# Altium project bumblebee 2.0.PrjPcb
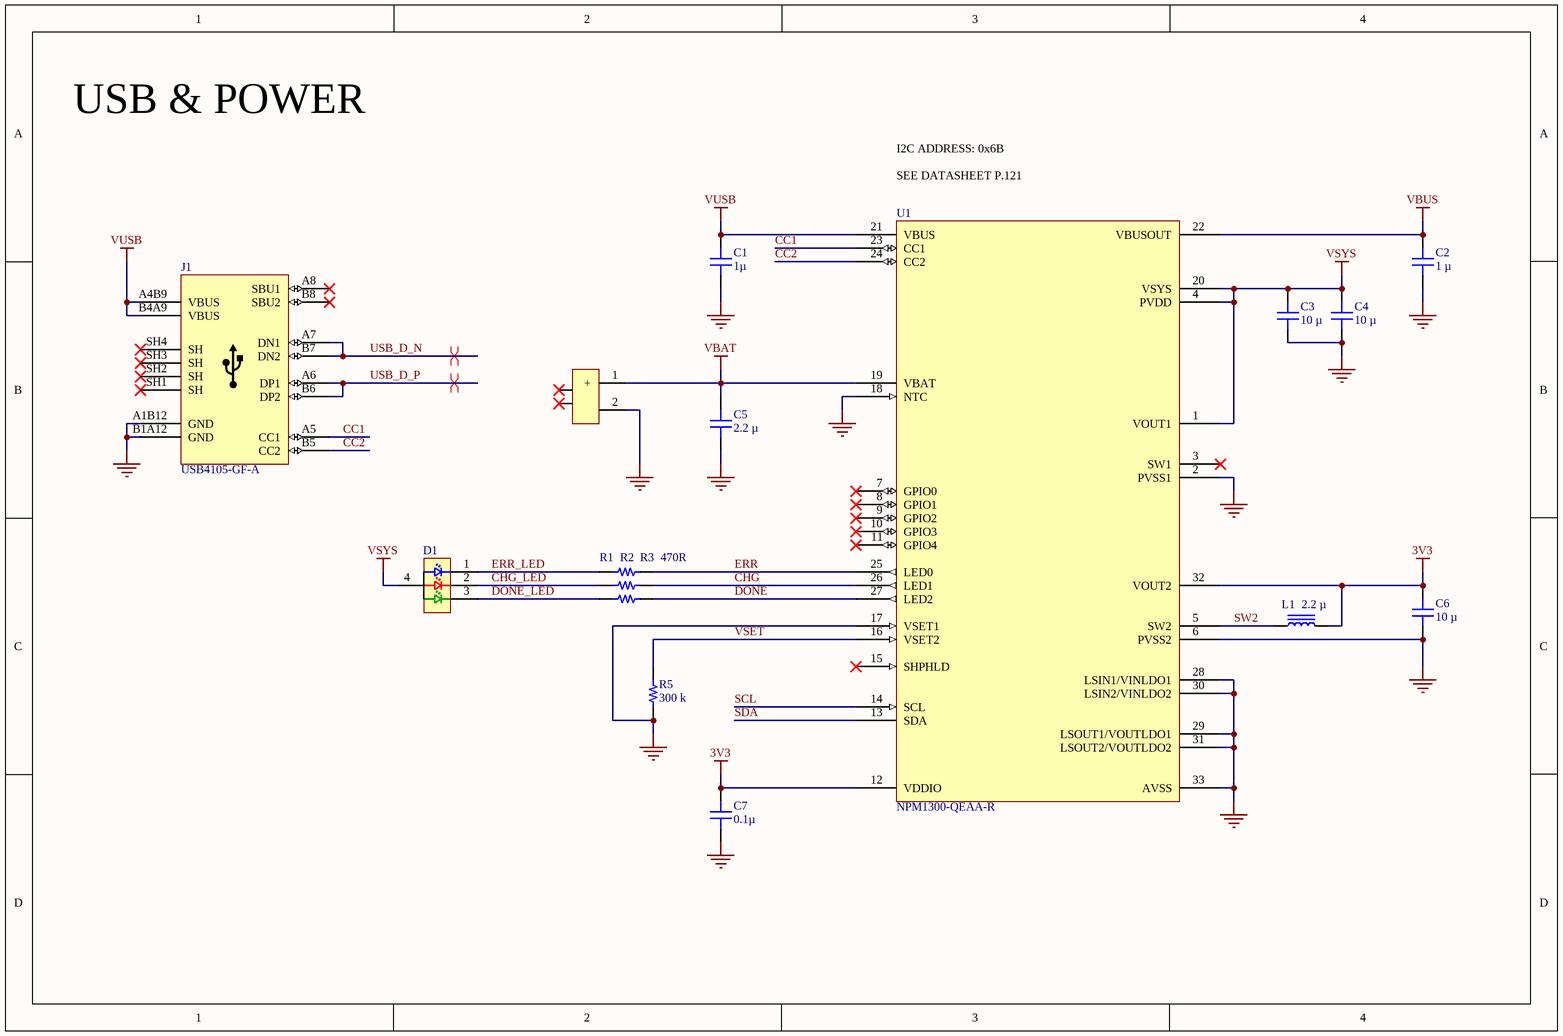
[diagram p0: 1_power.SchDoc]
3 sheets, 50 parts. Net scope: global (net labels, ports and power ports of the same name join across sheets).
Board file: bumblebee.PcbDoc
Sheets:
  1_power.SchDoc
  2_mcu.SchDoc
  3_peripherals.SchDoc

## Sheet 1_power.SchDoc: bumblebee macropad
size A4; DrawnBy: Samir Ahmed; DocumentNumber: 1; Revision: 0.2; SheetNumber: 1; SheetTotal: 3; ENG_APP_DATE: --/--/--; DSN_APP_DATE: --/--/--; CHK_APP_DATE: --/--/--

### Parts
C1  1µ  [CAP 0402_1005]
C2  1 µ  [CAP 0402_1005]
C3  10 µ  [CAP 0402_1005]
C4  10 µ  [CAP 0402_1005]
C5  2.2 µ  [CAP 0402_1005]
C6  10 µ  [CAP 0402_1005]
C7  0.1µ  [CAP 0402_1005]
D1  Red, Green, Blue (RGB)  [Citizen CL-505S-X-SD-T]  (value not drawn)
J1  USB4105-GF-A  [GCT_USB4105-GF-A]
J2  T1M-02-T-SH-L-K  [SAMTEC_T1M-02-T-SH-L-K]  (value not drawn)
L1  2.2 µ  [IND 0402_1005]
R1  470R  [RES 0402_1005]
R2  470 Ohms  [RES 0402_1005]  (value not drawn)
R3  470 Ohms  [RES 0402_1005]  (value not drawn)
R5  300 k  [RES 0402_1005]
U1  NPM1300-QEAA-R  [Nordic_QFN50P500X500X90-33N]

### Nets
3V3: C6.2 C7.2 L1.2 U1.12(VDDIO) U1.32(VOUT2)
GND: C1.1 C2.1 C3.2 C4.2 C5.1 C6.1 C7.1 J1.A1B12(GND) J1.B1A12(GND) J2.2 R5.1 U1.2(PVSS1) U1.6(PVSS2) U1.17(VSET1) U1.18(NTC) U1.28(LSIN1/VINLDO1) U1.29(LSOUT1/VOUTLDO1) U1.30(LSIN2/VINLDO2) U1.31(LSOUT2/VOUTLDO2) U1.33(AVSS)
VBAT: C5.2 J2.1(+) U1.19(VBAT)
VBUS: C2.2 U1.22(VBUSOUT)
VSYS: C3.1 C4.1 D1.4(A3) U1.1(VOUT1) U1.4(PVDD) U1.20(VSYS)
VUSB: C1.2 J1.A4B9(VBUS) J1.B4A9(VBUS) U1.21(VBUS)
CC1: J1.A5(CC1) U1.23(CC1)
CC2: J1.B5(CC2) U1.24(CC2)
CHG: R2.2 U1.26(LED1)
CHG_LED: D1.2(C2) R2.1
DONE: R3.2 U1.27(LED2)
DONE_LED: D1.3(C3) R3.1
ERR: R1.2 U1.25(LED0)
ERR_LED: D1.1(C1) R1.1
SCL: U1.14(SCL)
SDA: U1.13(SDA)
SW2: L1.1 U1.5(SW2)
USB_D_N: J1.A7(DN1) J1.B7(DN2)
USB_D_P: J1.A6(DP1) J1.B6(DP2)
VSET: R5.2 U1.16(VSET2)

Not connected (* = marked no-connect by the designer): J1 A8(SBU1)* B8(SBU2)* SH1(SH)* SH2(SH)* SH3(SH)* SH4(SH)*; J2 S1(NC)* S2(NC)*; U1 3(SW1)* 7(GPIO0)* 8(GPIO1)* 9(GPIO2)* 10(GPIO3)* 11(GPIO4)* 15(SHPHLD)*

### Layout directives
differential pair: USB_D_N, USB_D_P

### Notes on the sheet
- USB & POWER
- (near U1) I2C ADDRESS: 0x6B
  SEE DATASHEET P.121
- DWG. NO.
- REV.
- SHT.
- THIS DOCUMENT AND THE DATA DISCLOSED HEREIN OR HEREWITH IS THE PROPERTY OF ALTIUM LIMITED AND MAY BE FREELY DISTRIBUTED IN WHOLE. NO RIGHTS ARE RESERVED OR EXPRESS OR IMPLIED WARANTEE GIVEN.
- REVISION
- DESCRIPTION
- DATE
- APPROVED
- ENG:
- APPROVALS
- PROJECT
- DSN:
- CHK:
- REFERENCE DOCUMENTS
- PROJECT REVISION:
- TITLE
- DOCUMENT REVISION:
- DESIGN ITEM:
- BOM:
- FAB DWG:
- PCB DWG:
- ASSY DWG:
- SCALE:
- SIZE
- B
- CAGE CODE
- FILE NAME
- DWG NO.
- SHEET
- OF
- REV

### Library data of the parts
C1 = 885012105012: CAP CER 1UF 10V X5R 0402; manufacturer: Würth Elektronik; Capacitance: 1 µF; Tolerance: ±20%; Part Number: 885012105012; Value: 1µ; Applications: General Purpose; componentlink1description: Datasheet; componentlink1url: https://katalog.we-online.de/pbs/datasheet/885012105012.pdf; componentlink2description: DigiKey Link; componentlink2url: https://www.digikey.com/en/products/detail/würth-elektronik/885012105012/5453344; Device Package: 0402 (1005 Metric); lastupdated: 2/9/2024 8:04:38 PM; Lifecycle Status: Active; Minimum Order: 1; Mounting Type: Surface Mount, MLCC; Operating Temperature: -55°C ~ 85°C; Package / Case: 0402 (1005 Metric); packaging: TapeAndReel; partid: 1807; Part Status: Active; price: 0.16; series: WCAP-CSGP; Size / Dimension: 0.039" L x 0.020" W (1.00mm x 0.50mm); Supplier 1: DigiKey; Supplier Part Number 1: 732-7489-1-ND; Temperature Coefficient: X5R; Thickness (Max): 0.022" (0.55mm); Voltage - Rated: 10V
C2 = 885012105012: CAP CER 1UF 10V X5R 0402; manufacturer: Würth Elektronik; Tolerance: ±20%; Part Number: 885012105012; Value: 1 µ; Applications: General Purpose; Capacitance: 1 µ; componentlink1description: Datasheet; componentlink1url: https://katalog.we-online.de/pbs/datasheet/885012105012.pdf; componentlink2description: DigiKey Link; componentlink2url: https://www.digikey.com/en/products/detail/würth-elektronik/885012105012/5453344; Device Package: 0402 (1005 Metric); lastupdated: 2/9/2024 8:04:38 PM; Lifecycle Status: Active; Minimum Order: 1; Mounting Type: Surface Mount, MLCC; Operating Temperature: -55°C ~ 85°C; Package / Case: 0402 (1005 Metric); packaging: TapeAndReel; partid: 1807; Part Status: Active; price: 0.16; series: WCAP-CSGP; Size / Dimension: 0.039" L x 0.020" W (1.00mm x 0.50mm); Supplier 1: DigiKey; Supplier Part Number 1: 732-7489-1-ND; Temperature Coefficient: X5R; Thickness (Max): 0.022" (0.55mm); Voltage - Rated: 10V
C3 C4 C6 = CL05A106MP8NUB8: CAP CER 10UF 10V X5R 0402; manufacturer: Samsung Electro-Mechanics; Capacitance: 10 µF; Tolerance: ±20%; Part Number: CL05A106MP8NUB8; Value: 10 µ; Applications: Acoustic Noise Reduction; componentlink1description: Datasheet; componentlink1url: http://www.samsungsem.com/kr/support/product-search/mlcc/CL05A106MP8NUB8.jsp; componentlink2description: DigiKey Link; componentlink2url: https://www.digikey.com/en/products/detail/samsung-electro-mechanics/CL05A106MP8NUB8/5961314; Device Package: 0402 (1005 Metric); lastupdated: 2/9/2024 8:04:38 PM; Lifecycle Status: Active; Minimum Order: 1; Mounting Type: Surface Mount, MLCC; Operating Temperature: -55°C ~ 85°C; Package / Case: 0402 (1005 Metric); packaging: TapeAndReel; partid: 1758; Part Status: Active; price: 0.06; series: CL; Size / Dimension: 0.039" L x 0.020" W (1.00mm x 0.50mm); Supplier 1: DigiKey; Supplier Part Number 1: 1276-6830-1-ND; Temperature Coefficient: X5R; Thickness (Max): 0.035" (0.90mm); Voltage - Rated: 10V
C5 = TMK105CBJ225KV-F: CAP CER 2.2UF 25V X5R 0402; manufacturer: Taiyo Yuden; Capacitance: 2.2 µF; Tolerance: ±10%; Part Number: TMK105CBJ225KV-F; Value: 2.2 µ; Applications: SMPS Filtering; componentlink1description: Datasheet; componentlink1url: https://ds.yuden.co.jp/TYCOMPAS/ut/detail?pn=TMK105CBJ225KV-F &u=M; componentlink2description: DigiKey Link; componentlink2url: https://www.digikey.com/en/products/detail/taiyo-yuden/TMK105CBJ225KV-F/7403799; Device Package: 0402 (1005 Metric); lastupdated: 2/9/2024 8:04:38 PM; Lifecycle Status: Active; Minimum Order: 1; Mounting Type: Surface Mount, MLCC; Operating Temperature: -55°C ~ 85°C; Package / Case: 0402 (1005 Metric); packaging: TapeAndReel; partid: 1822; Part Status: Active; price: 0.02; series: M; Size / Dimension: 0.039" L x 0.020" W (1.00mm x 0.50mm); Supplier 1: DigiKey; Supplier Part Number 1: 587-6277-1-ND; Temperature Coefficient: X5R; Thickness (Max): 0.028" (0.70mm); Voltage - Rated: 25V
C7 = 0402ZC104KAT2A: CAP CER 0.1UF 10V X7R 0402; manufacturer: AVX Corporation; Capacitance: 0.1µF; Tolerance: ±10%; Part Number: 0402ZC104KAT2A; Value: 0.1µ; Applications: General Purpose; componentlink1description: Datasheet; componentlink1url: http://datasheets.avx.com/X7RDielectric.pdf; componentlink2description: DigiKey Link; componentlink2url: http://digikey.com/product-detail/en/avx-corporation/0402ZC104KAT2A/478-7891-1-ND/3881514; Device Package: 0402 (1005 Metric); lastupdated: 2/8/2022 12:26:59 PM; Lifecycle Status: Active; Minimum Order: 1; Mounting Type: Surface Mount, MLCC; Operating Temperature: -55°C ~ 125°C; Package / Case: 0402 (1005 Metric); packaging: TapeAndReel; partid: 1757; Part Status: Active; price: 0.09; series: -; Size / Dimension: 0.039" L x 0.020" W (1.00mm x 0.50mm); Supplier 1: DigiKey; Supplier Part Number 1: 478-7891-1-ND; Temperature Coefficient: X7R; Thickness (Max): 0.022" (0.55mm); Voltage - Rated: 10V
D1 = CL-505S-X-SD-T: LED TRI TOP FIRING 1.0 X 1.0; Manufacturer: Citizen; Configuration: Common Anode; Current - Test: 5mA Red, 5mA Green, 5mA Blue; Lens Color: 0.26mm; Lens Size: 1.00mm; Lens Style: Square with Flat Top; Millicandela Rating: 40mcd Red, 220mcd Green, 65mcd Blue; Voltage - Forward (Vf) (Typ): 1.85V Red, 2.7V Green, 2.75V Blue; Wavelength - Dominant: 615nm Red, 530nm Green, 470nm Blue; Part Number: CL-505S-X-SD-T; Color: Red, Green, Blue (RGB); ComponentLink1Description: Datasheet; ComponentLink1URL: http://ce.citizen.co.jp/up_img/product/sQNrj4RlM7o2/CL-505S_e.pdf; ComponentLink2Description: DigiKey Link; ComponentLink2URL: http://digikey.com/product-detail/en/citizen/CL-505S-X-SD-T/1642-1510-1-ND/6005950; Device Package: 0404 (1010 Metric); Height (Max): 0.26mm; LastUpdated: 3/19/2020 10:25:23 PM; Lifecycle Status: Active; Minimum Order: 1; Mounting Type: Surface Mount; Package / Case: 0404 (1010 Metric); Packaging: TapeAndReel; PartId: 955; Part Status: Active; Price: 0.23; Series: CL-505S; Size / Dimension: 1.00mm L x 1.00mm W; Supplier 1: DigiKey; Supplier Part Number 1: 1642-1510-1-ND; Value: Red, Green, Blue (RGB)
J1 = CMP-002-00080-3: USB-C (USB TYPE-C) USB 2.0 Receptacle Connector 24 (16+8 Dummy) Position Surface Mount, Right Angle; Through Hole; Gender: Female; Pins: 16; Source: USB4105-GF-A.SchLib; MP: USB4105-GF-A; Mounting Technology: SMT; Connector Type: USB-C; Design Item ID: USB4105-GF-A; Case/Package: None; Component Type: Standard
J2 = CMP-015-000000-3: 1mm JST Connector, surface mounted, horizontal orientation.; Gender: Female; Package: None; RoHS Compliant: RoHS3 Compliant; Mounting Technology: Surface Mounted; Pins: 2; Manufacturer Part #: T1M-02-T-SH-L-K
L1 = FCI1005F-2R2M: IND  2.2UH  1.7OHM  10MA; Manufacturer: TAI-TECH Advanced Electronics Co., Ltd.; DC Resistance (DCR): 1.7Ohm Max; Frequency - Self Resonant: 28MHz; Inductance: 2.2 µH; Inductance Frequency - Test: 10 MHz; Q @ Freq: 20 @ 10MHz; Shielding: Unshielded; Tolerance: ±20%; Part Number: FCI1005F-2R2M; ComponentLink2Description: DigiKey Link; ComponentLink2URL: https://www.digikey.com/en/products/detail/tai-tech-advanced-electronics-co-ltd/FCI1005F-2R2M/21672129; Current Rating (Amps): 10 mA; Device Package: 0402 (1005 Metric); Height - Seated (Max): 0.024" (0.60mm); LastUpdated: 6/3/2024 8:12:05 PM; Lifecycle Status: Active; Minimum Order: 1; Mounting Type: Surface Mount; Operating Temperature: -55°C ~ 105°C; Package / Case: 0402 (1005 Metric); Packaging: TapeAndReel; PartId: 7361; Price: 0.01; Series: FCI1005F; Size / Dimension: 0.039" L x 0.020" W (1.00mm x 0.50mm); Supplier 1: DigiKey; Supplier Part Number 1: 4816-FCI1005F-2R2MCT-ND; Supplier Device Package: 0402; Value: 2.2 µ
R1 = TNPW0402470RBYEP: RES 470 OHM 0.1% 1/16W 0402; Manufacturer: Vishay Dale; Power (Watts): 0.1W, 1/10W; Resistance: 470 Ohms; Temperature Coefficient: ±10ppm/°C; Part Number: TNPW0402470RBYEP; Value: 470R; ComponentLink1Description: Datasheet; ComponentLink1URL: http://www.vishay.com/docs/28758/tnpw_e3.pdf; ComponentLink2Description: DigiKey Link; ComponentLink2URL: http://digikey.com/product-detail/en/vishay-dale/TNPW0402470RBYEP/541-9810-1-ND/9562435; Composition: Thin Film; Device Package: 0402 (1005 Metric); Features: Anti-Sulfur, Automotive AEC-Q200, Moisture Resistant; Height - Seated (Max): 0.016" (0.40mm); LastUpdated: 2/9/2024 8:30:21 PM; Lifecycle Status: Active; Minimum Order: 1; Number of Terminations: 2; Operating Temperature: -55°C ~ 155°C; Package / Case: 0402 (1005 Metric); Packaging: TapeAndReel; PartId: 3068; Part Status: Active; Price: 0.27; Ratings: AEC-Q200; Series: TNPW e3; Size / Dimension: 0.039" L x 0.020" W (1.00mm x 0.50mm); Supplier 1: DigiKey; Supplier Part Number 1: 541-9810-1-ND; Supplier Device Package: 0402; Tolerance: ±0.1%
R2 R3 = TNPW0402470RBYEP: RES 470 OHM 0.1% 1/16W 0402; Manufacturer: Vishay Dale; Power (Watts): 0.1W, 1/10W; Temperature Coefficient: ±10ppm/°C; Part Number: TNPW0402470RBYEP; Value: 470 Ohms; ComponentLink1Description: Datasheet; ComponentLink1URL: http://www.vishay.com/docs/28758/tnpw_e3.pdf; ComponentLink2Description: DigiKey Link; ComponentLink2URL: http://digikey.com/product-detail/en/vishay-dale/TNPW0402470RBYEP/541-9810-1-ND/9562435; Composition: Thin Film; Device Package: 0402 (1005 Metric); Features: Anti-Sulfur, Automotive AEC-Q200, Moisture Resistant; Height - Seated (Max): 0.016" (0.40mm); LastUpdated: 2/9/2024 8:30:21 PM; Lifecycle Status: Active; Minimum Order: 1; Number of Terminations: 2; Operating Temperature: -55°C ~ 155°C; Package / Case: 0402 (1005 Metric); Packaging: TapeAndReel; PartId: 3068; Part Status: Active; Price: 0.27; Ratings: AEC-Q200; Resistance: 470 Ohms; Series: TNPW e3; Size / Dimension: 0.039" L x 0.020" W (1.00mm x 0.50mm); Supplier 1: DigiKey; Supplier Part Number 1: 541-9810-1-ND; Supplier Device Package: 0402; Tolerance: ±0.1%
R5 = RC0402JR-07300KL: RES 300K OHM 5% 1/16W 0402; Manufacturer: Yageo; Power (Watts): 0.063W, 1/16W; Resistance: 300 kOhms; Temperature Coefficient: ±100ppm/°C; Part Number: RC0402JR-07300KL; Value: 300 k; ComponentLink1Description: Datasheet; ComponentLink1URL: https://www.yageo.com/upload/media/product/productsearch/datasheet/rchip/PYu-RC_Group_51_RoHS_L_10.pdf; ComponentLink2Description: DigiKey Link; ComponentLink2URL: https://www.digikey.com/en/products/detail/yageo/RC0402JR-07300KL/726462; Composition: Thick Film; Device Package: 0402 (1005 Metric); Features: Moisture Resistant; Height - Seated (Max): 0.016" (0.40mm); LastUpdated: 2/9/2024 8:30:13 PM; Lifecycle Status: Active; Minimum Order: 1; Number of Terminations: 2; Operating Temperature: -55°C ~ 155°C; Package / Case: 0402 (1005 Metric); Packaging: CutTape; PartId: 4858; Part Status: Active; Price: 0.01; Series: RC_L; Size / Dimension: 0.039" L x 0.020" W (1.00mm x 0.50mm); Supplier 1: DigiKey; Supplier Part Number 1: 311-300KJRCT-ND; Supplier Device Package: 0402; Tolerance: ±5%
U1 = CMP-00029-00006-5: Battery Power Management IC Lithium Ion/Polymer 32-QFN (5x5); Max Operating Temperature: 85°C; Manufacturer Part #: NPM1300-QEAA-R; Mounting Technology: Surface Mount; Min Operating Temperature: 40°C; RoHS Compliant: ROHS3 Compliant; JLCPCB Part #: C7466043; Pins: 33; Case/Package: 32-QFN (5x5)

## Sheet 2_mcu.SchDoc
size A4; SheetNumber: 2; SheetTotal: 2
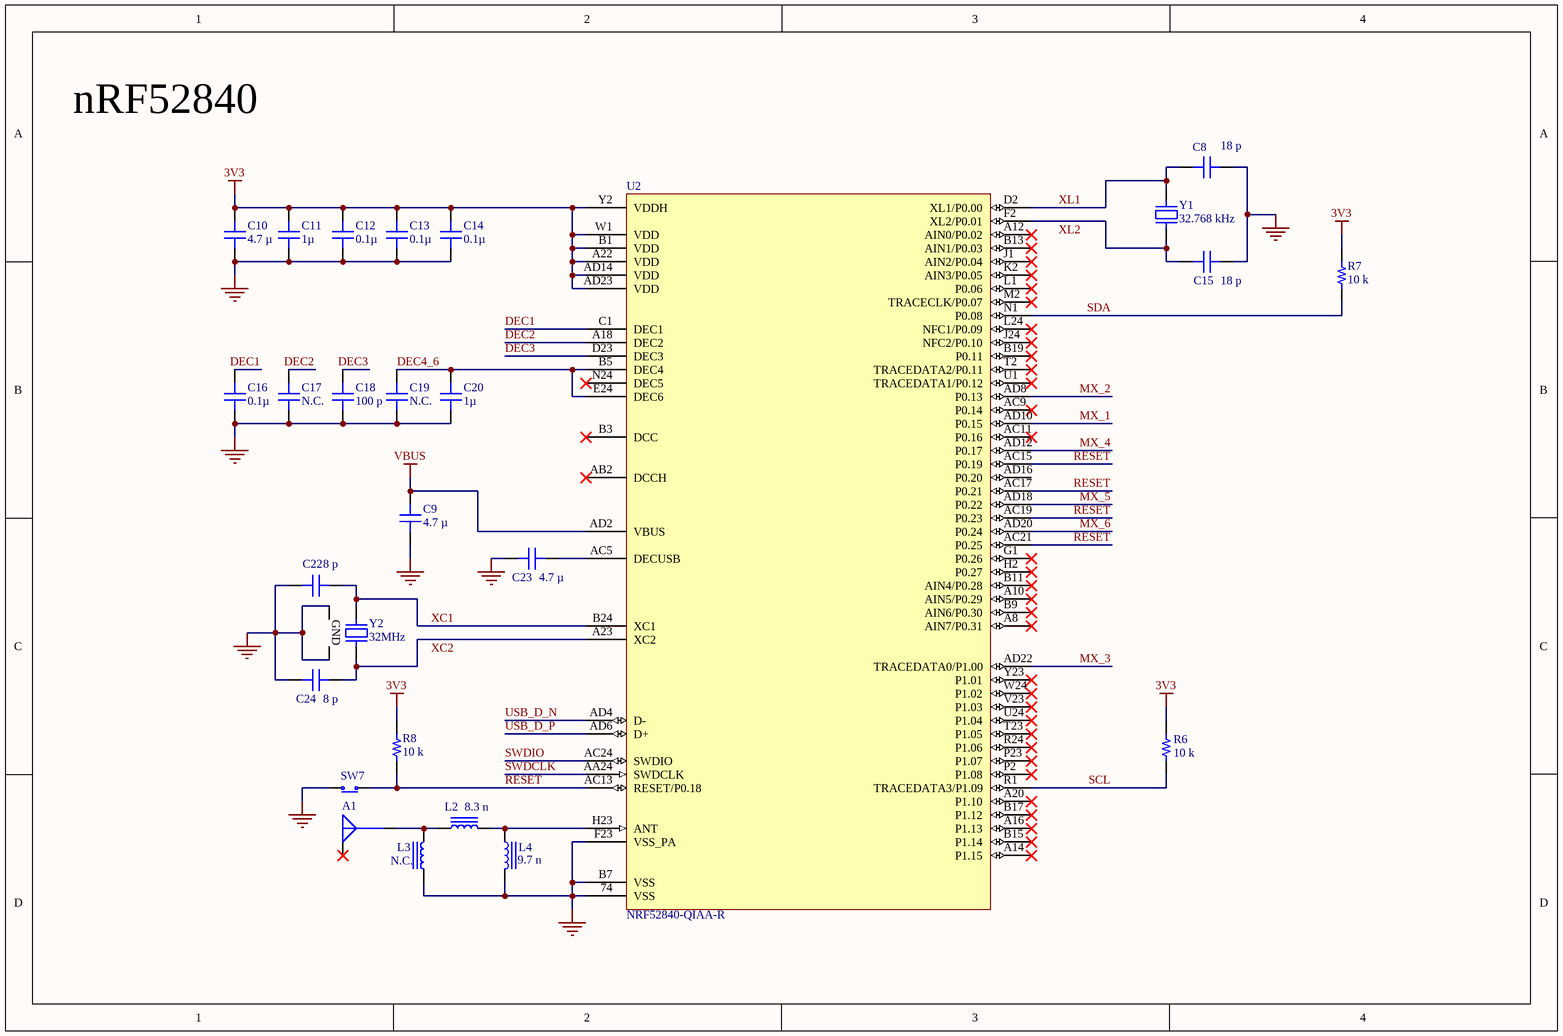
[diagram p1: 2_mcu.SchDoc]

### Parts
A1  AMCA31-2R450G-S1F-T3  [FP-AMCA31-MFG]  (value not drawn)
C8  18 p  [CAP 0402_1005]
C9  4.7 µ  [CAP 0402_1005]
C10  4.7 µ  [CAP 0402_1005]
C11  1µ  [CAP 0402_1005]
C12  0.1µ  [CAP 0402_1005]
C13  0.1µ  [CAP 0402_1005]
C14  0.1µ  [CAP 0402_1005]
C15  18 p  [CAP 0402_1005]
C16  0.1µ  [CAP 0402_1005]
C17  N.C.  [CAP 0402_1005]
C18  100 p  [CAP 0402_1005]
C19  N.C.  [CAP 0402_1005]
C20  1µ  [CAP 0402_1005]
C22  8 p  [CAP 0402_1005]
C23  4.7 µ  [CAP 0402_1005]
C24  8 p  [CAP 0402_1005]
L2  8.3 n  [IND 0402_1005]
L3  N.C.  [IND 0402_1005]
L4  9.7 n  [IND 0402_1005]
R6  10 k  [RES 0402_1005]
R7  10 k  [RES 0402_1005]
R8  10 k  [RES 0402_1005]
SW7  PTS840 GK SMTR LFS  [EVQP7A_J_B_K]  (value not drawn)
U2  NRF52840-QIAA-R  [NRSC-AQFN-73]
Y1  32.768 kHz  [ABRACON ABS06]
Y2  32MHz  [BT-XTAL_2016]

### Nets
3V3: C10.2 C11.2 C12.2 C13.2 C14.2 R6.1 R7.2 R8.1 U2.A22(VDD) U2.AD14(VDD) U2.AD23(VDD) U2.B1(VDD) U2.W1(VDD) U2.Y2(VDDH)
GND: C8.2 C9.1 C10.1 C11.1 C12.1 C13.1 C14.1 C15.2 C16.1 C17.1 C18.1 C19.1 C20.1 C22.1 C23.2 C24.1 L3.1 L4.2 SW7.1(N.O) U2.74(VSS) U2.B7(VSS) U2.F23(VSS_PA) Y2.2(GND) Y2.4(GND)
VBUS: C9.2 U2.AD2(VBUS)
DEC1: C16.2 U2.C1(DEC1)
DEC2: C17.2 U2.A18(DEC2)
DEC3: C18.2 U2.D23(DEC3)
DEC4_6: C19.2 C20.2 U2.B5(DEC4) U2.E24(DEC6)
MX_1: U2.AD10(P0.15)
MX_2: U2.AD8(P0.13)
MX_3: U2.AD22(TRACEDATA0/P1.00)
MX_4: U2.AD12(P0.17)
MX_5: U2.AD18(P0.22)
MX_6: U2.AD20(P0.24)
RESET: R8.2 SW7.2(COM) U2.AC13(RESET/P0.18) U2.AC15(P0.19) U2.AC17(P0.21) U2.AC19(P0.23) U2.AC21(P0.25)
SCL: R6.2 U2.R1(TRACEDATA3/P1.09)
SDA: R7.1 U2.N1(P0.08)
SWDCLK: U2.AA24(SWDCLK)
SWDIO: U2.AC24(SWDIO)
USB_D_N: U2.AD4(D-)
USB_D_P: U2.AD6(D+)
XC1: C22.2 U2.B24(XC1) Y2.1(IN)
XC2: C24.2 U2.A23(XC2) Y2.3(OUT)
XL1: C8.1 U2.D2(XL1/P0.00) Y1.2
XL2: C15.1 U2.F2(XL2/P0.01) Y1.1
NetA1_1: A1.1(Feed_Point) L2.1 L3.2
NetC23_1: C23.1 U2.AC5(DECUSB)
NetL2_2: L2.2 L4.1 U2.H23(ANT)

Not connected (* = marked no-connect by the designer): A1 2(NC)*; U2 A8(AIN7/P0.31)* A10(AIN5/P0.29)* A12(AIN0/P0.02)* A14(P1.15)* A16(P1.13)* A20(P1.10)* AB2(DCCH)* AC9(P0.14)* AC11(P0.16)* AD16(P0.20) B3(DCC)* B9(AIN6/P0.30)* B11(AIN4/P0.28)* B13(AIN1/P0.03)* B15(P1.14)* B17(P1.12)* B19(P0.11)* G1(P0.26)* H2(P0.27)* J1(AIN2/P0.04)* J24(NFC2/P0.10)* K2(AIN3/P0.05)* L1(P0.06)* L24(NFC1/P0.09)* M2(TRACECLK/P0.07)* N24(DEC5)* P2(P1.08)* P23(P1.07)* R24(P1.06)* T2(TRACEDATA2/P0.11)* T23(P1.05)* U1(TRACEDATA1/P0.12)* U24(P1.04)* V23(P1.03)* W24(P1.02)* Y23(P1.01)*

### Notes on the sheet
- nRF52840
- Title:
- Project:
- Revision:
- Organization:
- Date:
- Sheet
- of
- University of South Florida
- Drawn by:
- File:
- Size:

### Library data of the parts
A1 = CMP-00025-00004-1: 2.45GHz Bluetooth, IoT, ISM, M2M, Wi-Fi, ZigBee™ Chip RF Antenna 2.4GHz ~ 2.5GHz 2.3dBi Solder Surface Mount; Power - Max: 3 W; Impedance: 50Ω; RF Family/Standard: Bluetooth, General ISM, WiFi; Frequency: 2.45GHz; Case/Package: Chip; RoHS Compliant: ROHS3 Compliant; Pins: 2; Gain: 2.3dBi; Max Operating Temperature: 85°C; Mounting Technology: Surface Mount; Min Operating Temperature: -40°C
C8 C15 = HMK105CG180JV-F: CAP CER 18PF 100V C0G/NP0 0402; manufacturer: Taiyo Yuden; Temperature Coefficient: C0G, NP0; Tolerance: ±5%; Part Number: HMK105CG180JV-F; Value: 18 p; Applications: General Purpose; Capacitance: 18 pF; componentlink1description: Datasheet; componentlink1url: http://www.yuden.co.jp/productdata/catalog/mlcc06_e.pdf; componentlink2description: DigiKey Link; componentlink2url: https://www.digikey.com/en/products/detail/taiyo-yuden/HMK105CG180JV-F/6563596; Device Package: 0402 (1005 Metric); lastupdated: 2/9/2024 8:04:38 PM; Lifecycle Status: Active; Minimum Order: 1; Mounting Type: Surface Mount, MLCC; Operating Temperature: -55°C ~ 125°C; Package / Case: 0402 (1005 Metric); packaging: TapeAndReel; partid: 1849; Part Status: Active; price: 0.03; series: M; Size / Dimension: 0.039" L x 0.020" W (1.00mm x 0.50mm); Supplier 1: DigiKey; Supplier Part Number 1: 587-5003-1-ND; Thickness (Max): 0.022" (0.55mm); Voltage - Rated: 100V
C9 C10 C23 = CL05A475MO5NUNC: CAP CER 4.7UF 16V X5R 0402; manufacturer: Samsung Electro-Mechanics; Capacitance: 4.7 µF; Tolerance: ±20%; Part Number: CL05A475MO5NUNC; Value: 4.7 µ; Applications: General Purpose; componentlink1description: Datasheet; componentlink1url: http://www.samsungsem.com/kr/support/product-search/mlcc/__icsFiles/afieldfile/2019/05/29/Data%20sheet_CL05A475MO5NUNC.pdf; componentlink2description: DigiKey Link; componentlink2url: https://www.digikey.com/en/products/detail/samsung-electro-mechanics/CL05A475MO5NUNC/5961320; Device Package: 0402 (1005 Metric); lastupdated: 2/9/2024 8:04:38 PM; Lifecycle Status: Active; Minimum Order: 1; Mounting Type: Surface Mount, MLCC; Operating Temperature: -55°C ~ 85°C; Package / Case: 0402 (1005 Metric); packaging: TapeAndReel; partid: 1760; Part Status: Active; price: 0.08; series: CL; Size / Dimension: 0.039" L x 0.020" W (1.00mm x 0.50mm); Supplier 1: DigiKey; Supplier Part Number 1: 1276-6836-1-ND; Temperature Coefficient: X5R; Thickness (Max): 0.028" (0.70mm); Voltage - Rated: 16V
C11 C20 = 885012105012: as C1 on sheet 1_power; Part Number: 885012105012; Value: 1µ; Applications: General Purpose; componentlink1description: Datasheet; componentlink1url: https://katalog.we-online.de/pbs/datasheet/885012105012.pdf; componentlink2description: DigiKey Link; componentlink2url: https://www.digikey.com/en/products/detail/würth-elektronik/885012105012/5453344; Device Package: 0402 (1005 Metric); lastupdated: 2/9/2024 8:04:38 PM; Lifecycle Status: Active; Minimum Order: 1; Mounting Type: Surface Mount, MLCC; Operating Temperature: -55°C ~ 85°C; Package / Case: 0402 (1005 Metric); packaging: TapeAndReel; partid: 1807; Part Status: Active; price: 0.16; series: WCAP-CSGP; Size / Dimension: 0.039" L x 0.020" W (1.00mm x 0.50mm); Supplier 1: DigiKey; Supplier Part Number 1: 732-7489-1-ND; Temperature Coefficient: X5R; Thickness (Max): 0.022" (0.55mm); Voltage - Rated: 10V
C12-C14 C16 C17 C19 = 0402ZC104KAT2A: as C7 on sheet 1_power; Part Number: 0402ZC104KAT2A; Applications: General Purpose; componentlink1description: Datasheet; componentlink1url: http://datasheets.avx.com/X7RDielectric.pdf; componentlink2description: DigiKey Link; componentlink2url: http://digikey.com/product-detail/en/avx-corporation/0402ZC104KAT2A/478-7891-1-ND/3881514; Device Package: 0402 (1005 Metric); lastupdated: 2/8/2022 12:26:59 PM; Lifecycle Status: Active; Minimum Order: 1; Mounting Type: Surface Mount, MLCC; Operating Temperature: -55°C ~ 125°C; Package / Case: 0402 (1005 Metric); packaging: TapeAndReel; partid: 1757; Part Status: Active; price: 0.09; series: -; Size / Dimension: 0.039" L x 0.020" W (1.00mm x 0.50mm); Supplier 1: DigiKey; Supplier Part Number 1: 478-7891-1-ND; Temperature Coefficient: X7R; Thickness (Max): 0.022" (0.55mm); Voltage - Rated: 10V
  C12-C14 C16: Value: 0.1µ
  C17 C19: Value: N.C.
C18 = 500X07N101MV4T: CAP CER 100PF 50V C0G/NP0 0402; manufacturer: Johanson Dielectrics Inc.; Temperature Coefficient: C0G, NP0; Tolerance: ±20%; Part Number: 500X07N101MV4T; Value: 100 p; Applications: Bypass, Decoupling; Capacitance: 100 pF; componentlink1description: Datasheet; componentlink1url: https://www.johansondielectrics.com/downloads/x2y-filter-and-decoupling-capacitors.pdf; componentlink2description: DigiKey Link; componentlink2url: https://www.digikey.com/en/products/detail/johanson-dielectrics-inc/500X07N101MV4T/2046917; Device Package: 0402 (1005 Metric); Features: Low ESL (X2Y); lastupdated: 2/9/2024 8:04:38 PM; Lifecycle Status: Active; Minimum Order: 1; Mounting Type: Surface Mount, MLCC; Operating Temperature: -55°C ~ 125°C; Package / Case: 0402 (1005 Metric); packaging: TapeAndReel; partid: 1767; Part Status: Active; price: 0.08; series: X2Y®; Size / Dimension: 0.045" L x 0.025" W (1.14mm x 0.64mm); Supplier 1: DigiKey; Supplier Part Number 1: 709-1214-1-ND; Thickness (Max): 0.020" (0.51mm); Voltage - Rated: 50V
C22 C24 = C1005NP01H080D050BA: CAP CER 8PF 50V NP0 0402; manufacturer: TDK Corporation; Temperature Coefficient: C0G, NP0; Tolerance: ±0.5pF; Part Number: C1005NP01H080D050BA; Value: 8 p; Applications: General Purpose; Capacitance: 8 pF; componentlink1description: Datasheet; componentlink1url: https://product.tdk.com/info/en/catalog/datasheets/mlcc_commercial_hightemp_en.pdf?ref_disty=digikey; componentlink2description: DigiKey Link; componentlink2url: https://www.digikey.com/en/products/detail/tdk-corporation/C1005NP01H080D050BA/3951017; Device Package: 0402 (1005 Metric); Features: High Temperature; lastupdated: 2/9/2024 8:04:37 PM; Lifecycle Status: Active; Minimum Order: 1; Mounting Type: Surface Mount, MLCC; Operating Temperature: -55°C ~ 150°C; Package / Case: 0402 (1005 Metric); packaging: TapeAndReel; partid: 2033; Part Status: Active; price: 0.01; series: C; Size / Dimension: 0.039" L x 0.020" W (1.00mm x 0.50mm); Supplier 1: DigiKey; Supplier Part Number 1: 445-13781-1-ND; Thickness (Max): 0.022" (0.55mm); Voltage - Rated: 50V
L2 = LQW15AN8N3G80D: FIXED IND 8.3NH 1.5A 0.069OHM SM; Manufacturer: Murata Electronics; DC Resistance (DCR): 69mOhm Max; Frequency - Self Resonant: 6.5GHz; Inductance Frequency - Test: 100 MHz; Material - Core: Non-Magnetic; Q @ Freq: 32 @ 250MHz; Shielding: Unshielded; Tolerance: ±2%; Type: Drum Core, Wirewound; Part Number: LQW15AN8N3G80D; ComponentLink1Description: Datasheet; ComponentLink1URL: https://search.murata.co.jp/Ceramy/image/img/P02/JELF243A-0100.pdf; ComponentLink2Description: DigiKey Link; ComponentLink2URL: https://www.digikey.com/en/products/detail/murata-electronics/LQW15AN8N3G80D/4292394; Current Rating (Amps): 1.5 A; Device Package: 0402 (1005 Metric); Height - Seated (Max): 0.024" (0.60mm); Inductance: 8.3 nH; LastUpdated: 6/3/2024 8:12:57 PM; Lifecycle Status: Active; Minimum Order: 1; Mounting Type: Surface Mount; Operating Temperature: -55°C ~ 125°C; Package / Case: 0402 (1005 Metric); Packaging: TapeAndReel; PartId: 4902; Part Status: Active; Price: 0.07; Series: LQW15; Size / Dimension: 0.039" L x 0.024" W (1.00mm x 0.60mm); Supplier 1: DigiKey; Supplier Part Number 1: 490-7681-1-ND; Value: 8.3 n
L3 = LQW15AN8N3G80D: FIXED IND 8.3NH 1.5A 0.069OHM SM; Manufacturer: Murata Electronics; DC Resistance (DCR): 69mOhm Max; Frequency - Self Resonant: 6.5GHz; Inductance Frequency - Test: 100 MHz; Material - Core: Non-Magnetic; Q @ Freq: 32 @ 250MHz; Shielding: Unshielded; Tolerance: ±2%; Type: Drum Core, Wirewound; Value: 8.3 n; Part Number: LQW15AN8N3G80D; ComponentLink1Description: Datasheet; ComponentLink1URL: https://search.murata.co.jp/Ceramy/image/img/P02/JELF243A-0100.pdf; ComponentLink2Description: DigiKey Link; ComponentLink2URL: https://www.digikey.com/en/products/detail/murata-electronics/LQW15AN8N3G80D/4292394; Current Rating (Amps): 1.5 A; Device Package: 0402 (1005 Metric); Height - Seated (Max): 0.024" (0.60mm); Inductance: 8.3 nH; LastUpdated: 6/3/2024 8:12:57 PM; Lifecycle Status: Active; Minimum Order: 1; Mounting Type: Surface Mount; Operating Temperature: -55°C ~ 125°C; Package / Case: 0402 (1005 Metric); Packaging: TapeAndReel; PartId: 4902; Part Status: Active; Price: 0.07; Series: LQW15; Size / Dimension: 0.039" L x 0.024" W (1.00mm x 0.60mm); Supplier 1: DigiKey; Supplier Part Number 1: 490-7681-1-ND
L4 = LQW15AN9N7J80D: FIXED IND 9.7NH 1.4A 81 MOHM SMD; Manufacturer: Murata Electronics; DC Resistance (DCR): 81mOhm Max; Frequency - Self Resonant: 6GHz; Inductance Frequency - Test: 100 MHz; Material - Core: Non-Magnetic; Q @ Freq: 33 @ 250MHz; Shielding: Unshielded; Tolerance: ±5%; Type: Wirewound; Part Number: LQW15AN9N7J80D; ComponentLink1Description: Datasheet; ComponentLink1URL: https://search.murata.co.jp/Ceramy/image/img/P02/JELF243A-0100.pdf; ComponentLink2Description: DigiKey Link; ComponentLink2URL: https://www.digikey.com/en/products/detail/murata-electronics/LQW15AN9N7J80D/4292401; Current Rating (Amps): 1.4 A; Device Package: 0402 (1005 Metric); Height - Seated (Max): 0.024" (0.60mm); Inductance: 9.7 nH; LastUpdated: 6/3/2024 8:13:02 PM; Lifecycle Status: Active; Minimum Order: 1; Mounting Type: Surface Mount; Operating Temperature: -55°C ~ 125°C; Package / Case: 0402 (1005 Metric); Packaging: TapeAndReel; PartId: 4964; Part Status: Active; Price: 0.06; Series: LQW15; Size / Dimension: 0.039" L x 0.024" W (1.00mm x 0.60mm); Supplier 1: DigiKey; Supplier Part Number 1: 490-7688-1-ND; Value: 9.7 n
R6-R8 = RP73PF1E10KBTD: RES 10K OHM 0.1% 1/10W 0402; Manufacturer: TE Connectivity Passive Product; Power (Watts): 0.1W, 1/10W; Resistance: 10 kOhms; Temperature Coefficient: ±25ppm/°C; Part Number: RP73PF1E10KBTD; Value: 10 k; ComponentLink1Description: Datasheet; ComponentLink1URL: https://www.te.com/commerce/DocumentDelivery/DDEController?Action=srchrtrv&DocNm=1773272&DocType=DS&DocLang=English; ComponentLink2Description: DigiKey Link; ComponentLink2URL: https://www.digikey.com/en/products/detail/te-connectivity-passive-product/RP73PF1E10KBTD/8260957; Composition: Thin Film; Device Package: 0402 (1005 Metric); Height - Seated (Max): 0.014" (0.35mm); LastUpdated: 2/9/2024 8:30:24 PM; Lifecycle Status: Active; Minimum Order: 1; Number of Terminations: 2; Operating Temperature: -55°C ~ 155°C; Package / Case: 0402 (1005 Metric); Packaging: TapeAndReel; PartId: 2434; Part Status: Active; Price: 0.08; Series: RP73, Holsworthy; Size / Dimension: 0.039" L x 0.020" W (1.00mm x 0.50mm); Supplier 1: DigiKey; Supplier Part Number 1: A127415CT-ND; Supplier Device Package: 0402; Tolerance: ±0.1%
SW7 = CMP-011-00017-1: Microminiature SMT Switch, Side Actuated; Manufacturer: C&K; Part number Norautron: N.A.; Part number IPS: 00000001260; Artikkelnr Noca: 50019089; Pad Count: 4; Note: Tactile Switch, SPST, SMD, 220gf; Author: rsk; Manufacturer Part Number: PTS840 GK SMTR LFS; HelpURL: http://www.ck-components.com/80185/pts840_11june13.pdf/; Component Type: Standard; Part Number: PTS840 GK SMTR LFS; Source: pca10059.SCHLIB; ComponentLink2Description: Supplier link; ComponentLink2URL: N.A.; Component Class: Switches; Pins: 2; ComponentLink1Description: Datasheet; Published: 2014-08-12; PartId: 101500010; Value: PTS840 GK SMTR LFS; LatestRevisionDate: 2017-11-09; Design Item ID: PTS840 GK SMTR LFS; Footprint Doc: PTS840 Gx; ComponentLink1URL: N.A.
U2 = CMP-020-00027-11: IC RF TxRx + MCU 802.15.4, Bluetooth Bluetooth v5.0, Thread, Zigbee® 2.4GHz 73-VFQFN Dual Rows, Exposed Pad; RAM Size: 256kB RAM; Max Supply Voltage: 5.5V; Clock Frequency: 64MHz; I/Os: 48; Nominal Supply Voltage: 3.3V; Interface: ADC, I2S, PDM, PWM, SPI, TWI, UART, USB; Min Supply Voltage: 1.7V; Frequency: 2.4GHz; Pins: 73; Max Operating Temperature: 125°C; Case/Package: 73-VFQFN Dual Rows, Exposed Pad; JLCPCB Part #: C190794; Min Operating Temperature: -40°C; RoHS Compliant: ROHS3 Compliant; Mounting Technology: Surface Mount; Manufacturer Part #: NRF52840-QIAA-R
Y1 = ABS06-32.768KHZ-1-T: CRYSTAL 32.7680KHZ 12.5PF SMD; Manufacturer: Abracon LLC; ESR (Equivalent Series Resistance): 90 kOhms; Frequency Tolerance: ±10ppm; Operating Mode: Fundamental; Part Number: ABS06-32.768KHZ-1-T; ComponentLink1Description: Datasheet; ComponentLink1URL: https://abracon.com/Resonators/ABS06.pdf; ComponentLink2Description: DigiKey Link; ComponentLink2URL: https://www.digikey.com/en/products/detail/abracon-llc/ABS06-32-768KHZ-1-T/2217994; Frequency: 32.768 kHz; Height - Seated (Max): 0.024" (0.60mm); LastUpdated: 6/3/2024 8:02:03 PM; Lifecycle Status: Active; Load Capacitance: 12.5pF; Minimum Order: 1; Mounting Type: Surface Mount; Operating Temperature: -40°C ~ 85°C; Package / Case: 2-SMD, No Lead; Packaging: TapeAndReel; PartId: 370; Part Status: Active; Price: 0.33; Series: ABS06; Size / Dimension: 0.079" L x 0.047" W (2.00mm x 1.20mm); Supplier 1: DigiKey; Supplier Part Number 1: 535-10248-1-ND; Type: kHz Crystal (Tuning Fork); Value: 32.768 kHz
Y2 = CMP-003-00031-3: 32 MHz ±10ppm Crystal 8pF 60 Ohms 4-SMD, No Lead; ESR: 60; Min Operating Temperature: -30°C; Frequency: 32MHz; RoHS Compliant: ROHS3 Compliant; Pins: 4; Manufacturer Part #: XRCGB32M000F1H01R0; Load Capacitance: 8pF; Mounting Technology: Surface Mount; JLCPCB Part #: C914155; Max Operating Temperature: 85°C; Case/Package: 4-SMD, No Lead

## Sheet 3_peripherals.SchDoc
size A4; SheetNumber: 3; SheetTotal: 3
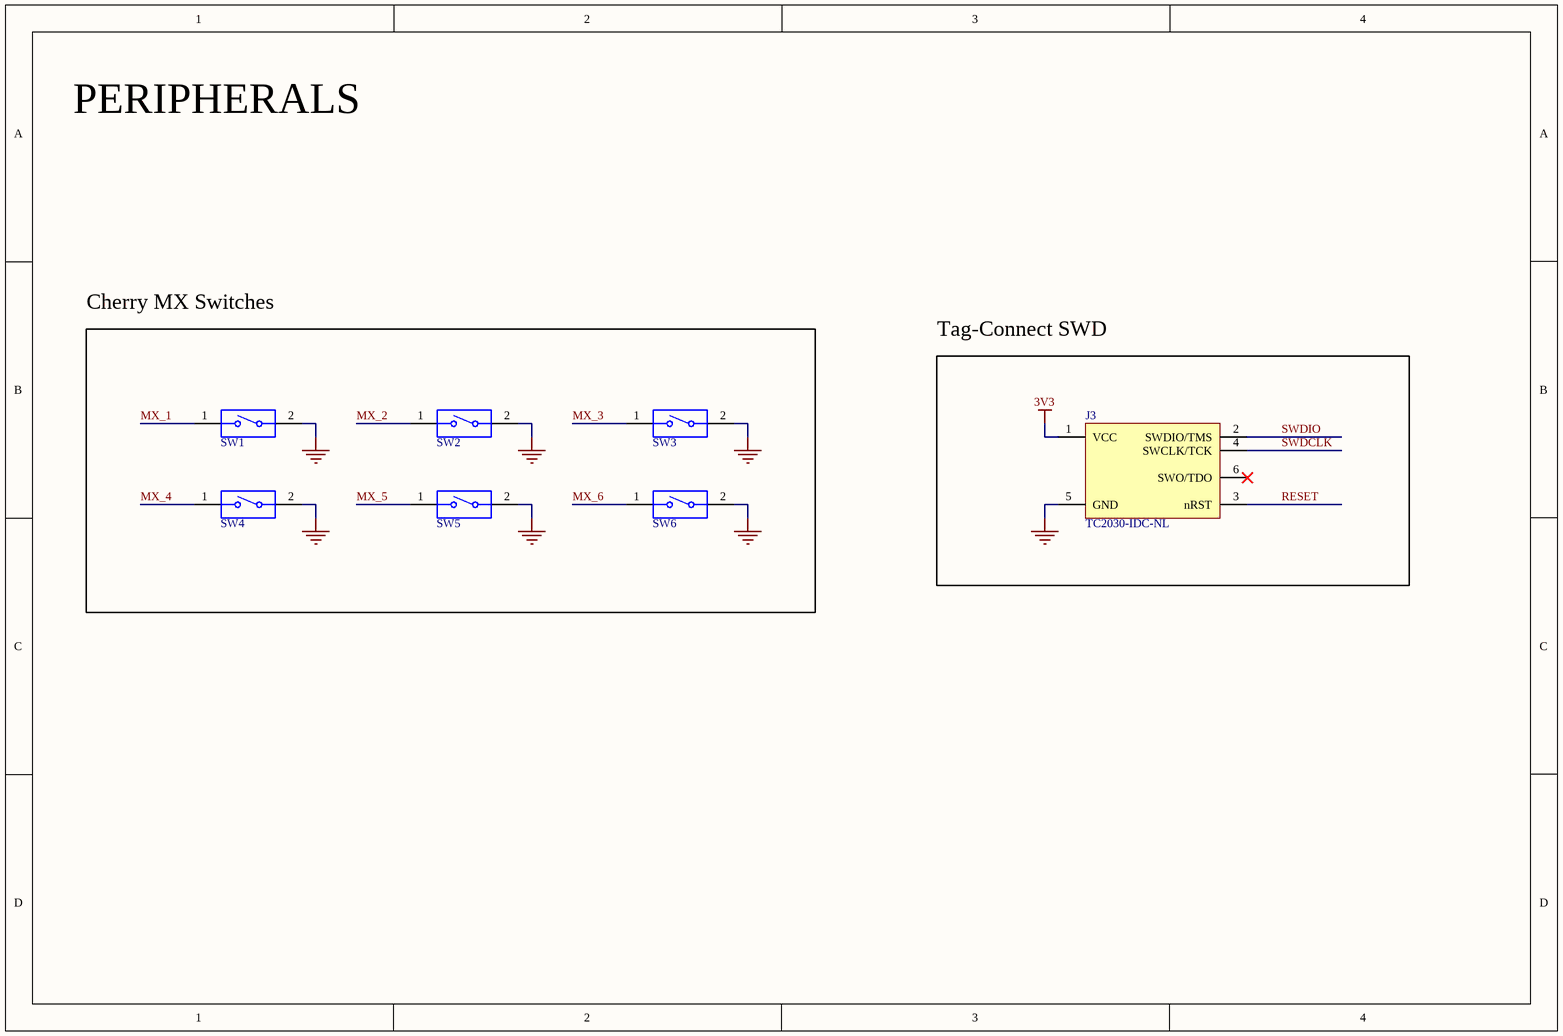
[diagram p2: 3_peripherals.SchDoc]

### Parts
J3  TC2030-IDC-NL  [TAG_TC2030-IDC-NL]
SW1  MX1A-11NW  [CHRY-MX1A-11NW_V]  (value not drawn)
SW2  MX1A-11NW  [CHRY-MX1A-11NW_V]  (value not drawn)
SW3  MX1A-11NW  [CHRY-MX1A-11NW_V]  (value not drawn)
SW4  MX1A-11NW  [CHRY-MX1A-11NW_V]  (value not drawn)
SW5  MX1A-11NW  [CHRY-MX1A-11NW_V]  (value not drawn)
SW6  MX1A-11NW  [CHRY-MX1A-11NW_V]  (value not drawn)

### Blocks framed on the sheet
Cherry MX Switches: SW1-SW6
Tag-Connect SWD: J3

### Nets
3V3: J3.1(VCC)
GND: J3.5(GND) SW1.2 SW2.2 SW3.2 SW4.2 SW5.2 SW6.2
MX_1: SW1.1
MX_2: SW2.1
MX_3: SW3.1
MX_4: SW4.1
MX_5: SW5.1
MX_6: SW6.1
RESET: J3.3(nRST)
SWDCLK: J3.4(SWCLK/TCK)
SWDIO: J3.2(SWDIO/TMS)

Not connected (* = marked no-connect by the designer): J3 6(SWO/TDO)*

### Notes on the sheet
- PERIPHERALS

### Library data of the parts
J3 = CMP-031-000000-3: CABLE ADAPTER 6 POS; Package: None; Value: *; Availability: https://www.tag-connect.com/product/tc2030-idc-nl; Pin Count: 6; Price: None; Component Type: Standard; Source: TC2030-IDC-NL.SchLib; Design Item ID: TC2030-IDC-NL; MP: TC2030-IDC-NL
SW1-SW6 = CMP-011-00018-1: Keypad Switch, 1 Switches, SPST, Momentary, 0.01A, 12VDC, 0.78N, Solder Terminal, Through Hole-straight; Manufacturer Series: MX; Contact Voltage(DC)-Max: 12V; Body Breadth: 15.6inch; Electrical Life: 50000000Cycles; Body Length or Diameter: 15.6mm; Contact Bounce Time-Max: 5ms; Circuit Configuration: 1X1; Body Height: 11.6mm; Contact DC Max Rating R Load: .01A@12VDC; Contact Current(DC)-Max: 10mA; Number of Switches: 1; Min Operating Temperature: -10°C; RoHS Compliant: Yes; Termination: Solder; Switch Action: MOMENTARY; Switch Type: Keypad; Operating Force-Max: 0.78N; Max Operating Temperature: 70°C; Switch Function: SPST; Mounting Technology: Through Hole; Reach SVHC Compliant: Yes

## Nets that join several sheets
3V3: 1_power (5 pins), 2_mcu (14 pins), 3_peripherals (J3.1)
GND: 1_power (20 pins), 2_mcu (24 pins), 3_peripherals (7 pins)
VBUS: 1_power (C2.2 U1.22), 2_mcu (C9.2 U2.AD2)
MX_1: 2_mcu (U2.AD10), 3_peripherals (SW1.1)
MX_2: 2_mcu (U2.AD8), 3_peripherals (SW2.1)
MX_3: 2_mcu (U2.AD22), 3_peripherals (SW3.1)
MX_4: 2_mcu (U2.AD12), 3_peripherals (SW4.1)
MX_5: 2_mcu (U2.AD18), 3_peripherals (SW5.1)
MX_6: 2_mcu (U2.AD20), 3_peripherals (SW6.1)
RESET: 2_mcu (7 pins), 3_peripherals (J3.3)
SCL: 1_power (U1.14), 2_mcu (R6.2 U2.R1)
SDA: 1_power (U1.13), 2_mcu (R7.1 U2.N1)
SWDCLK: 2_mcu (U2.AA24), 3_peripherals (J3.4)
SWDIO: 2_mcu (U2.AC24), 3_peripherals (J3.2)
USB_D_N: 1_power (J1.A7 J1.B7), 2_mcu (U2.AD4)
USB_D_P: 1_power (J1.A6 J1.B6), 2_mcu (U2.AD6)